# EAGLE design 2x35W AMP 1.6in x 1.2in (EAGLE 7.1.0)
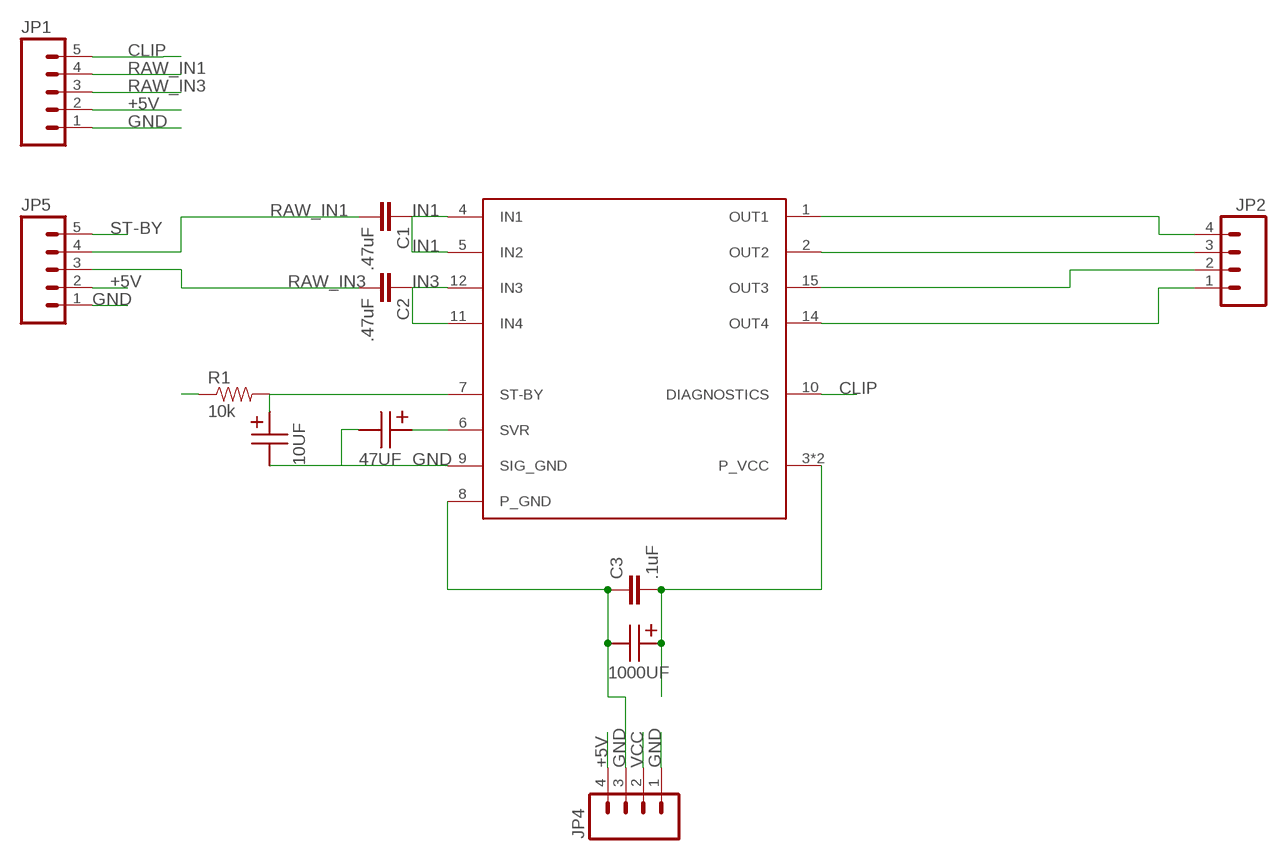
[diagram p0: schematic, sheet 1]

## Parts
10UF  5MM-12.5MM-POLAR2MMX5MM  [2MMLEAD_5MMDIAMETER]
47UF  5MM-12.5MM-POLAR2MMX5MM  [2MMLEAD_5MMDIAMETER]
1000UF  5MM-12.5MM-POLAR5MMX12.5MM  [5MMLEAD_12.5MMDIAMETER]
C1  .47uF  CAP1206  [1206]
C2  .47uF  CAP1206  [1206]
C3  .1uF  CAP1206  [1206]
JP1  M05SMD2  [1X05-1MM-RA]
JP2  M04SMD2  [1X04-1MM-RA]
JP4  M04SMD2  [1X04-1MM-RA]
JP5  M05SMD2  [1X05-1MM-RA]
R1  10k  RESISTORPTH-1/4W  [AXIAL-0.4]
U$1  TDA7375V  [MULTIWATT-15]

## Nets
+5V: JP1.2 JP4.4 JP5.2
CLIP: JP1.5 U$1.10(DIAGNOSTICS)
GND: 10UF.- 47UF.- 1000UF.- C3.1 JP1.1 JP4.1 JP4.3 JP5.1 U$1.8(P_GND) U$1.9(SIG_GND)
IN1: C1.1 U$1.4(IN1) U$1.5(IN2)
IN3: C2.1 U$1.11(IN4) U$1.12(IN3)
N$1: 10UF.+ R1.P$2 U$1.7(ST-BY)
N$2: 47UF.+ U$1.6(SVR)
OUT1: JP2.4 U$1.1(OUT1)
OUT2: JP2.3 U$1.2(OUT2)
OUT3: JP2.2 U$1.15(OUT3)
OUT4: JP2.1 U$1.14(OUT4)
RAW_IN1: C1.2 JP1.4 JP5.4
RAW_IN3: C2.2 JP1.3 JP5.3
ST-BY: JP5.5 R1.P$1
VCC: 1000UF.+ C3.2 JP4.2 U$1.3(P_VCC) U$1.13(P_VCC)

## Library data of the parts
10UF 47UF 1000UF = AMP Library:5MM-12.5MM-POLAR
C1-C3 = SparkFun-Passives:CAP: Capacitor Standard 0603 ceramic capacitor, and 0.1" leaded capacitor.
JP1 JP5 = SparkFun-Connectors:M05: Header 5 Standard 5-pin 0.1" header. Use with straight break away headers (SKU : PRT-00116), right angle break away headers (PRT-00553), swiss pins (PRT-00743), machine pins (PRT-00117), and female headers (PRT-00115). Molex polarized connector foot print use with SKU : PRT-08230 with associated crimp pins and housings.
JP2 JP4 = SparkFun-Connectors:M04: Header 4 Standard 4-pin 0.1" header. Use with straight break away headers (SKU : PRT-00116), right angle break away headers (PRT-00553), swiss pins (PRT-00743), machine pins (PRT-00117), and female headers (PRT-00115). Molex polarized connector foot print use with SKU : PRT-08231 with associated crimp pins and housings. 1MM SMD Version SKU: PRT-10208
R1 = SparkFun-Passives:RESISTOR: Resistor Basic schematic elements and footprints for 0603, 1206, and PTH resistors.
U$1 = AMP Library:TDA7375V

## Board
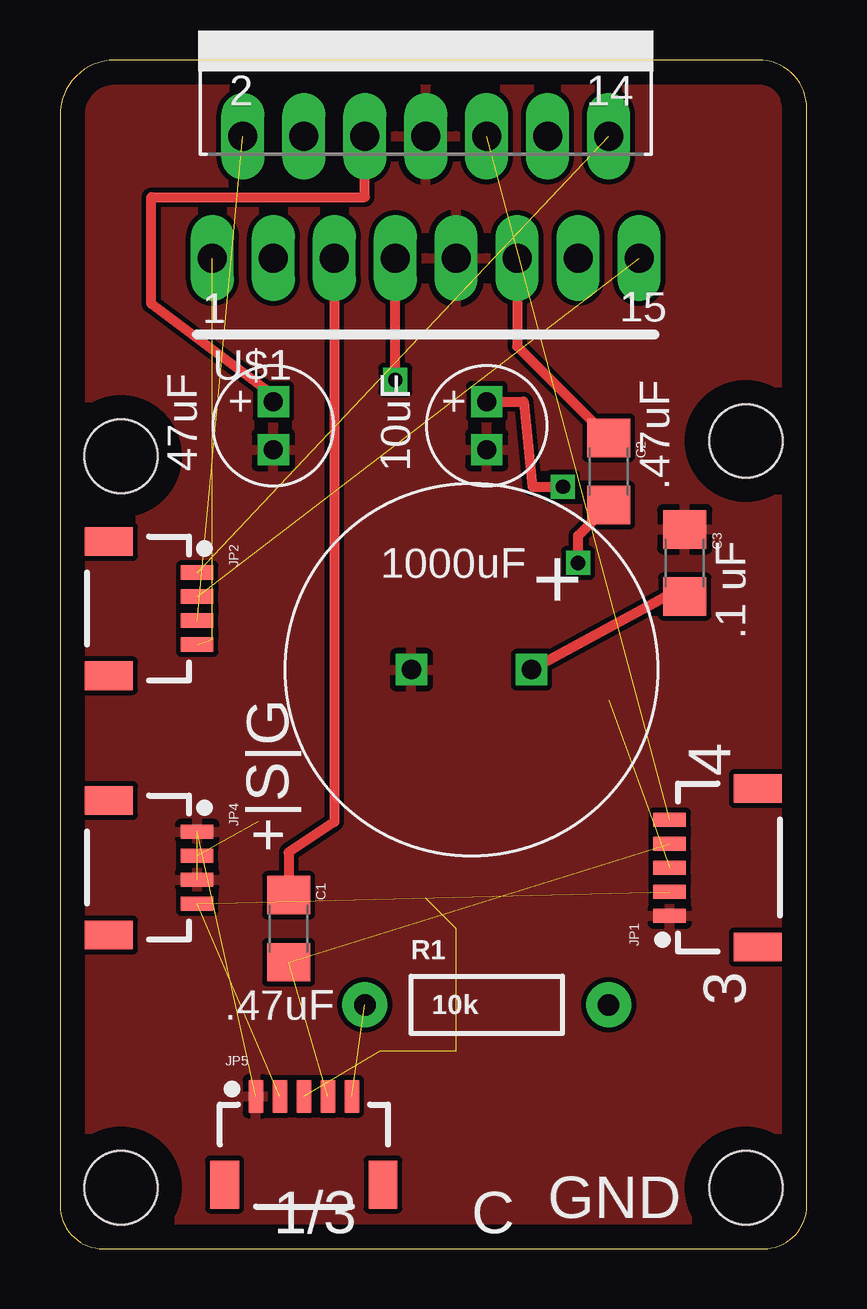
[diagram p1: board, top side]
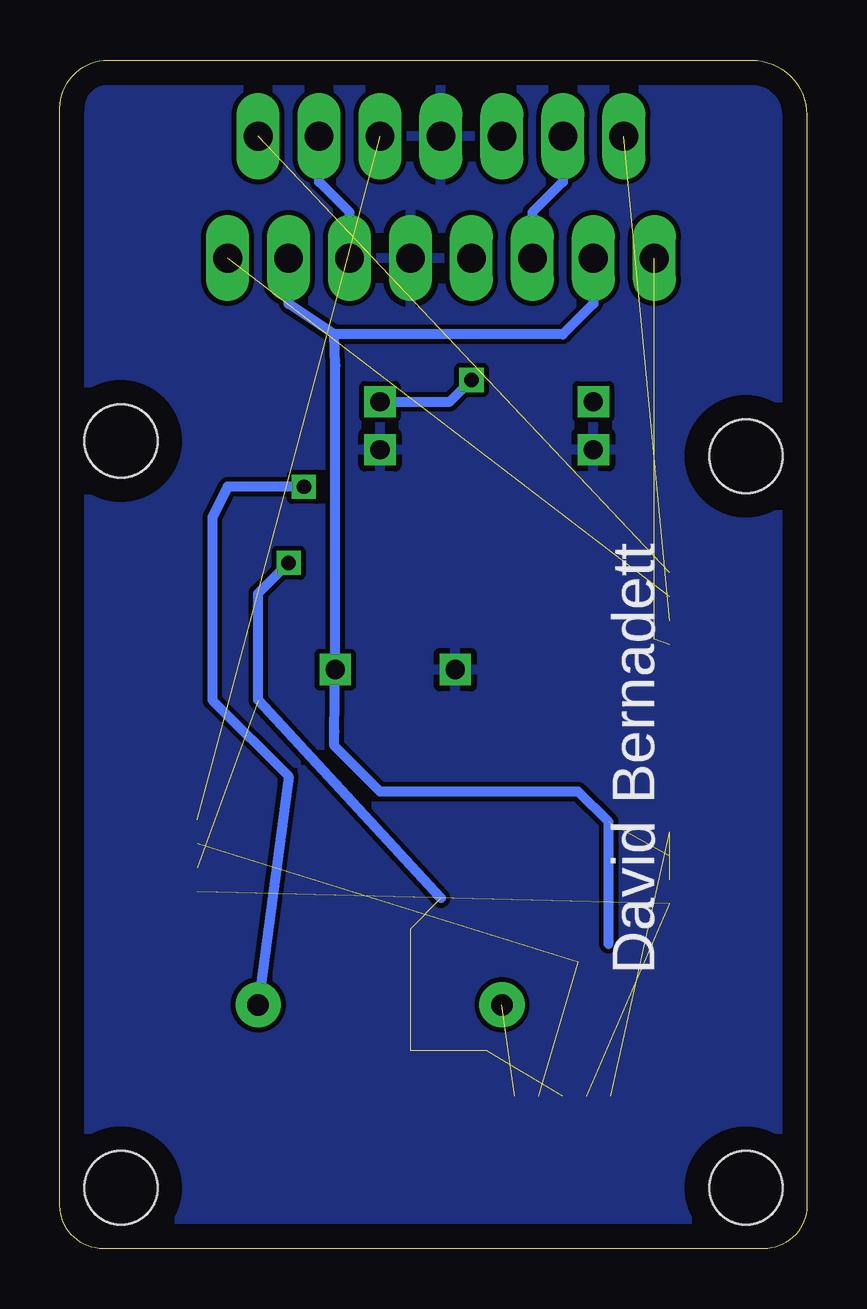
[diagram p2: board, bottom side, seen from below]

Size 31.11 x 49.53 mm. Coordinates in mm from the lower left corner, seen from the top.
Outline: 31.11,1.8 31.11,47.52 arc90 29.11,49.53 2.28,49.52 arc90 0,47.24 0,1.8 arc90 1.8,0 29.32,0 arc90 31.11,1.8
Copper layers (1*16): Top 0.035mm / dielectric 1.5mm / Bottom 0.035mm
Design rules "default": minimum track width 10mil, minimum drill 24mil, track to track 8mil, track to pad 8mil, pad to pad 8mil, via to via 8mil, smd to smd 8mil, copper to edge 40mil, drill to drill 8mil, minimum pad ring 10mil, minimum via ring 8mil, stop-mask expansion 4mil, vias tented up to drill 0mil, thermal gap 10mil

### Footprints (pad centres in the part's own frame; a part is rotated, then mirrored left to right if it is on the bottom)
2MMLEAD_5MMDIAMETER = drill 0.8 square: + 1,0; - -1,0
5MMLEAD_12.5MMDIAMETER = drill 0.8 square: + 2.5,0; - -2.5,0
1206 = smd 1.6 x 1.8: 1 -1.4,0; 2 1.4,0
1X05-1MM-RA = smd 0.6 x 1.35: 1 -2,0; 2 -1,0; 3 0,0; 4 1,0; 5 2,0 | smd 1.2 x 2: NC1 3.3,-3.675; NC2 -3.3,-3.675
1X04-1MM-RA = smd 0.6 x 1.35: 1 -1.5,0; 2 -0.5,0; 3 0.5,0; 4 1.5,0 | smd 1.2 x 2: NC1 2.8,-3.675; NC2 -2.8,-3.675
AXIAL-0.4 = drill 0.9 pad 1.88: P$1 -5.08,0; P$2 5.08,0
MULTIWATT-15 = drill 1.2 long: 1 -8.89,-7.62; 2 -7.62,-2.54; 3 -6.35,-7.62; 4 -5.08,-2.54; 5 -3.81,-7.62; 6 -2.54,-2.54; 7 -1.27,-7.62; 8 0,-2.54; 9 1.27,-7.62; 10 2.54,-2.54; 11 3.81,-7.62; 12 5.08,-2.54; 13 6.35,-7.62; 14 7.62,-2.54; 15 8.89,-7.62
STAND-OFF-TIGHT = hole 3.048: 0,0

### Placement (x,y rotation side)
10UF  17.78,34.29 90 top
47UF  8.89,34.29 90 top
1000UF  17.14,24.13 0 top
C1  9.53,13.34 270 top
C2  22.86,32.38 270 top
C3  26.04,28.57 270 top
JP1  25.4,15.88 90 top
JP2  5.71,26.67 270 top
JP4  5.71,15.88 270 top
JP5  10.16,6.35 0 top
R1  17.78,10.16 0 top
U$1  15.24,48.89 0 top
U$2  [STAND-OFF-TIGHT]  2.54,33.02 0 top
U$3  [STAND-OFF-TIGHT]  2.54,2.54 0 top
U$4  [STAND-OFF-TIGHT]  28.57,2.54 0 top
U$5  [STAND-OFF-TIGHT]  28.57,33.66 0 top

### Tracks (layer width: path | path; a pad name or v marks a point on that pad's centre or on a via)
+5V  (2 unrouted)
CLIP  (1 unrouted)
GND  (2 unrouted)
  pour Top: 0,49.53 31.11,49.53 31.11,0 0,0
  pour Bottom: 0,49.53 31.11,49.53 31.11,0 0,0
IN1
  Top 0.406: U$1.5 11.43,17.78 9.53,16.51 C1.1
  Bottom 0.406: U$1.4 10.16,44.45 11.43,43.18 U$1.5
IN3
  Top 0.406: U$1.11 19.05,37.59 C2.1
  Bottom 0.406: U$1.11 19.05,43.18 20.32,44.45 U$1.12
N$1  (via drill 0.6)
  Top 0.406: v13.97,36.2 U$1.7 | 10UF.+ 19.32,35.29 19.68,31.75 v20.95,31.75
  Bottom 0.406: 10UF.+ 14.88,35.29 v13.97,36.2 | v20.95,31.75 24.13,31.75 24.77,30.48 24.77,22.86 21.59,19.68 R1.P$2
N$2
  Top 0.406: 47UF.+ 8.89,35.56 3.81,39.37 3.81,43.81 12.7,43.81 U$1.6
OUT1  (2 unrouted)
OUT2  (1 unrouted)
OUT3  (1 unrouted)
OUT4  (1 unrouted)
RAW_IN1  (2 unrouted)
RAW_IN3  (via drill 0.6)  (5 unrouted)
  Top 0.406: v21.59,28.57 21.59,29.71 C2.2
  Bottom 0.406: 15.24,14.61 22.86,22.86 22.86,27.3 v21.59,28.57
ST-BY  (1 unrouted)
VCC  (1 unrouted)
  Top 0.406: C3.2 25.23,27.18 1000UF.+
  Bottom 0.406: U$1.3 8.89,39.37 10.16,38.1 19.68,38.1 | 19.68,38.1 21.59,39.37 U$1.13 | 19.68,38.1 19.64,36.79 1000UF.+ 19.68,21.55 19.68,20.95 17.78,19.05 9.53,19.05 8.26,17.78 8.26,12.7

### Text on the board
tPlace: 47uF | 10uF | 1000uF | 4 | +|S|G | 3 | GND | 1/3 | C
bPlace: David Bernadett
tNames: .47uF | .1 uF | .47uF